# EAGLE design zig-v4-test (EAGLE 5.10)
BOM: EXCLUDE; PARTNO: ERJ-3EKF51R0V
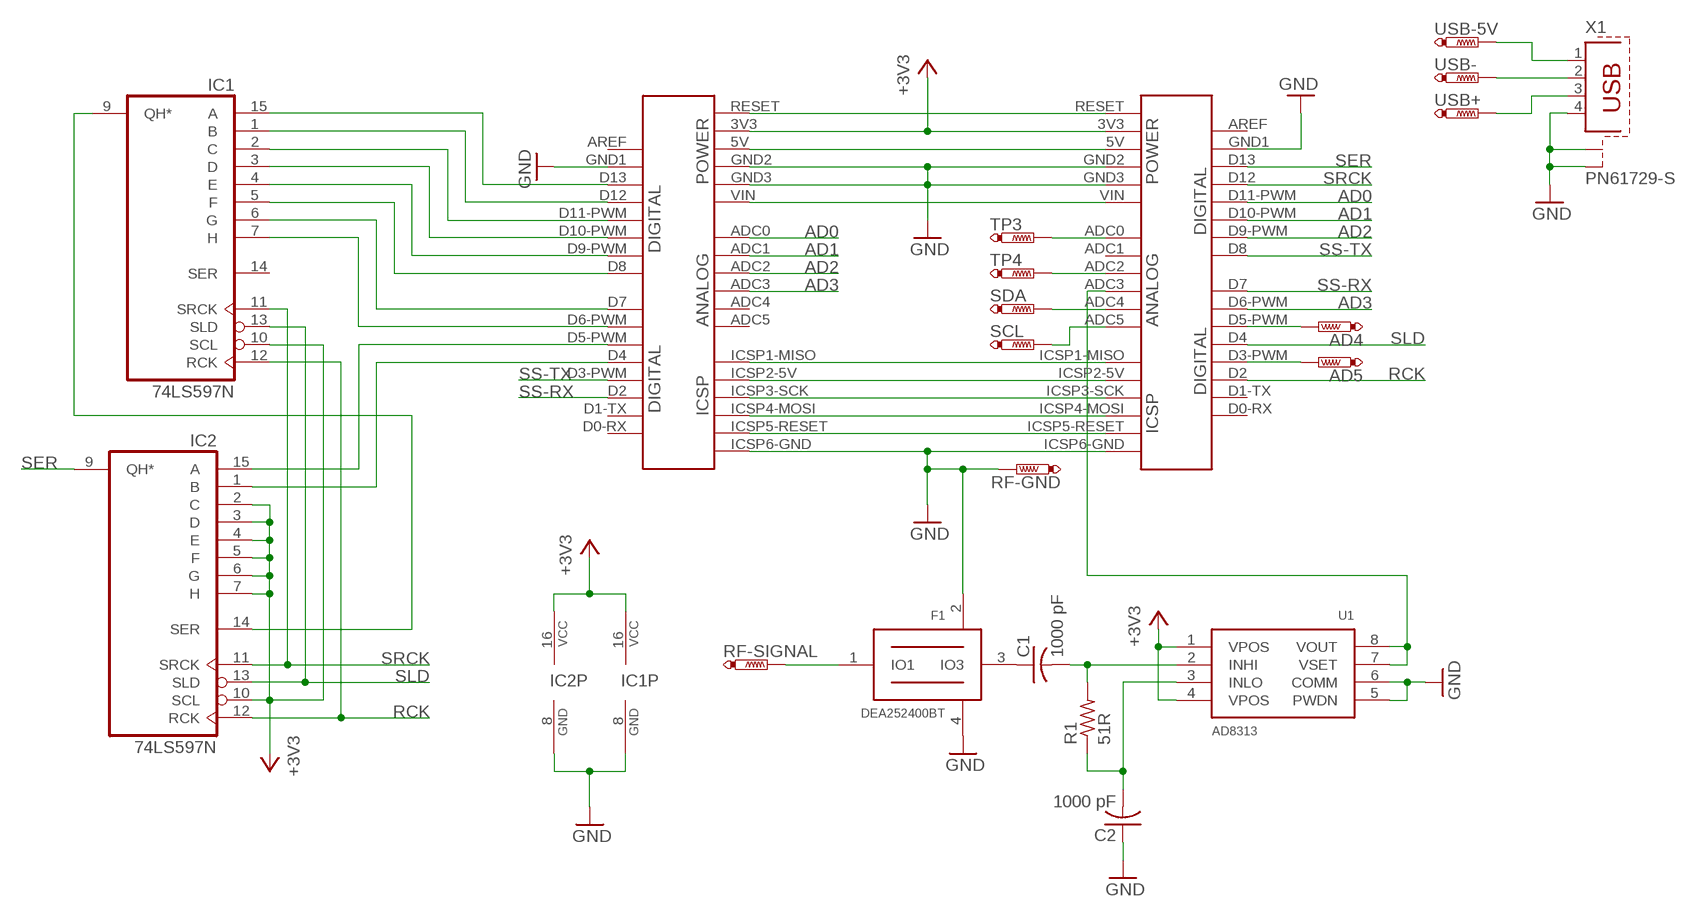
[diagram p0: schematic, sheet 1]

## Parts
AD4  PTR1PAD1-13  [P1-13]
AD5  PTR1PAD1-13  [P1-13]
C1  1000 pF  C-USC0805  [C0805]
C2  1000 pF  C-USC0805  [C0805]
DUT1  ARDUINO-2009-ICSP-TEST  [ARDUINO-2009-ICSP]
F1  DEA252400BT  [DEA2524]
IC1  74LS597N  [DIL16]
IC2  74LS597N  [DIL16]
R1  51R  R-US_R0805  [R0805]
RF-GND  PTR1PAD1-13  [P1-13]
RF-SIGNAL  PTR1PAD1-13  [P1-13]
SCL  PTR1PAD1-13  [P1-13]
SDA  PTR1PAD1-13  [P1-13]
SHIELD1  2009-ICSP  [2009-ICSP]
TP3  PTR1PAD1-13  [P1-13]
TP4  PTR1PAD1-13  [P1-13]
U1  AD8313  [MSOP8]
USB+  PTR1PAD1-13  [P1-13]
USB-  PTR1PAD1-13  [P1-13]
USB-5V  PTR1PAD1-13  [P1-13]
X1  PN61729-S  [PN61729-S]

## Nets
+3V3: DUT1.3V3 IC1.10(SCL) IC1.16(VCC) IC2.2(C) IC2.3(D) IC2.4(E) IC2.5(F) IC2.6(G) IC2.7(H) IC2.10(SCL) IC2.16(VCC) SHIELD1.3V3 U1.1(VPOS) U1.4(VPOS)
AD0: DUT1.ADC0 SHIELD1.D11-PWM(D11)
AD1: DUT1.ADC1 SHIELD1.D10-PWM(D10)
AD2: DUT1.ADC2 SHIELD1.D9-PWM(D9)
AD3: DUT1.ADC3 SHIELD1.D6-PWM(D6)
GND: C2.1 DUT1.GND1 DUT1.GND2 DUT1.GND3 DUT1.ICSP6-GND(GND-ICSP) F1.2(GND) F1.4(GND) IC1.8(GND) IC2.8(GND) RF-GND.TP SHIELD1.GND1 SHIELD1.GND2 SHIELD1.GND3 SHIELD1.ICSP6-GND(GND-ICSP) U1.5(PWDN) U1.6(COMM) X1.4 X1.S1 X1.S2
N$1: DUT1.RESET SHIELD1.RESET
N$2: AD5.TP SHIELD1.D3-PWM(D3)
N$3: DUT1.5V SHIELD1.5V
N$4: F1.1(IO1) RF-SIGNAL.TP
N$5: SHIELD1.ADC3 U1.7(VSET) U1.8(VOUT)
N$6: DUT1.VIN SHIELD1.VIN
N$7: C1.1 F1.3(IO3)
N$8: AD4.TP SHIELD1.D5-PWM(D5)
N$9: C2.2 R1.1 U1.3(INLO)
N$10: C1.2 R1.2 U1.2(INHI)
N$11: SDA.TP SHIELD1.ADC4
N$12: SCL.TP SHIELD1.ADC5
N$13: DUT1.ICSP1-MISO(MISO) SHIELD1.ICSP1-MISO(MISO)
N$14: DUT1.ICSP2-5V(5V-ICSP) SHIELD1.ICSP2-5V(5V-ICSP)
N$15: DUT1.ICSP3-SCK(SCK) SHIELD1.ICSP3-SCK(SCK)
N$16: DUT1.ICSP4-MOSI(MOSI) SHIELD1.ICSP4-MOSI(MOSI)
N$17: DUT1.ICSP5-RESET(RESET-ICSP) SHIELD1.ICSP5-RESET(RESET-ICSP)
N$18: SHIELD1.ADC2 TP4.TP
N$19: SHIELD1.ADC0 TP3.TP
N$20: DUT1.D13 IC1.15(A)
N$21: DUT1.D12 IC1.1(B)
N$22: DUT1.D11-PWM(D11) IC1.2(C)
N$23: DUT1.D10-PWM(D10) IC1.3(D)
N$24: DUT1.D9-PWM(D9) IC1.4(E)
N$25: DUT1.D8 IC1.5(F)
N$26: DUT1.D7 IC1.6(G)
N$27: DUT1.D6-PWM(D6) IC1.7(H)
N$28: DUT1.D5-PWM(D5) IC2.15(A)
N$29: DUT1.D4 IC2.1(B)
N$30: USB-5V.TP X1.1
N$31: USB-.TP X1.2
N$32: USB+.TP X1.3
N$34: IC1.9(QH*) IC2.14(SER)
RCK: IC1.12(RCK) IC2.12(RCK) SHIELD1.D2
SER: IC2.9(QH*) SHIELD1.D13
SLD: IC1.13(SLD) IC2.13(SLD) SHIELD1.D4
SRCK: IC1.11(SRCK) IC2.11(SRCK) SHIELD1.D12
SS-RX: DUT1.D2 SHIELD1.D7
SS-TX: DUT1.D3-PWM(D3) SHIELD1.D8
Unconnected: DUT1.ADC4 DUT1.ADC5 DUT1.AREF DUT1.D0-RX(D0) DUT1.D1-TX(D1) IC1.14(SER) SHIELD1.ADC1 SHIELD1.AREF SHIELD1.D0-RX(D0) SHIELD1.D1-TX(D1)

## Library data of the parts
AD4 AD5 RF-GND RF-SIGNAL SCL SDA TP3 TP4 USB+ USB- USB-5V = testpad:PTR1: TEST PIN
C1 C2 = resistor:C-US: CAPACITOR, American symbol
DUT1 = test-fixtures:ARDUINO-2009-ICSP-TEST
F1 = atmega128rfa1:DEA252400BT: TDK DEA252400BT 2.45 GHz bandpass filter
IC1 IC2 = 74xx-us:74*597: 8-bit SHIFT REGISTER, input latch
R1 = resistor:R-US_: RESISTOR, American symbol
SHIELD1 = arduino-shields:2009-ICSP
U1 = atmega128rfa1:AD8313
X1 = con-berg:PN61729-S: BERG USB connector

## Board
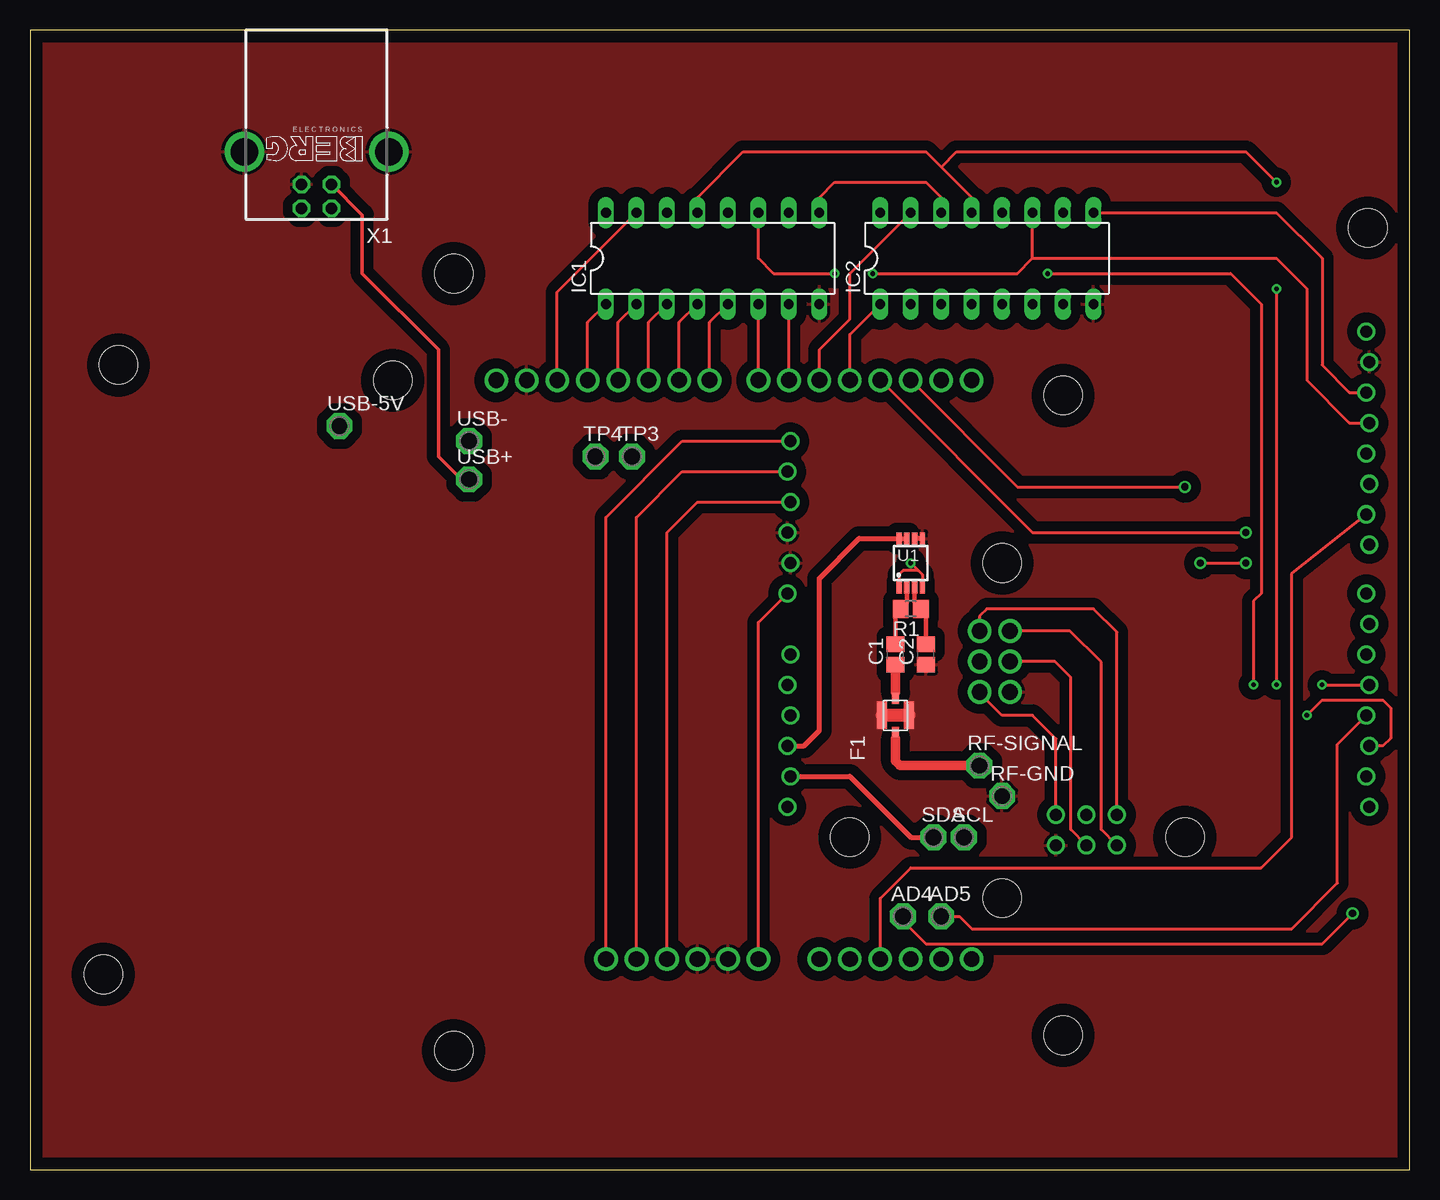
[diagram p1: board, top side]
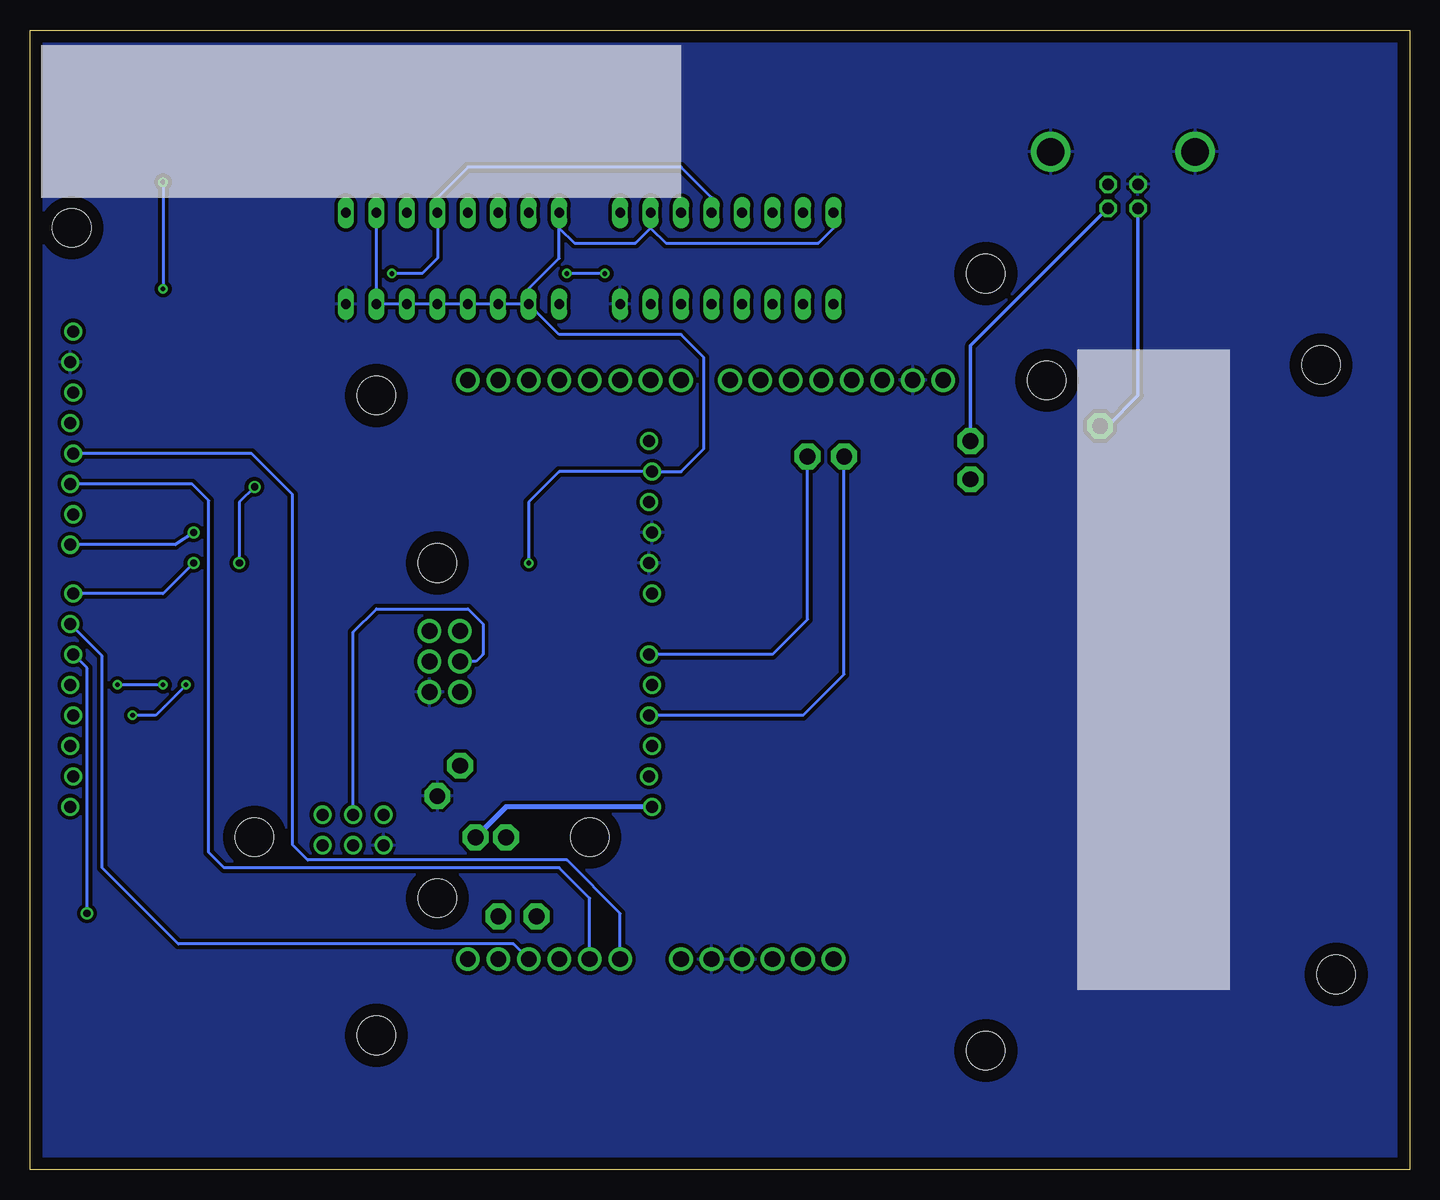
[diagram p2: board, bottom side, seen from below]

Size 115 x 95 mm. Coordinates in mm from the lower left corner, seen from the top.
Outline: 0,0 115,0 115,95 0,95 0,0
Copper layers (1*16): Top 0.035mm / dielectric 1.5mm / Bottom 0.035mm
Design rules "default": minimum track width 10mil, minimum drill 24mil, track to track 8mil, track to pad 8mil, pad to pad 8mil, via to via 8mil, smd to smd 8mil, copper to edge 40mil, drill to drill 8mil, minimum pad ring 10mil, minimum via ring 8mil, stop-mask expansion 4mil, vias tented up to drill 0mil, thermal gap 10mil
Holes 3.2 mm at 7.38,67.07 35.32,74.69 86.12,64.53 86.12,11.19 35.32,9.92 6.11,16.27

### Footprints (pad centres in the part's own frame; a part is rotated, then mirrored left to right if it is on the bottom)
P1-13 = drill 1.321 pad 2.159 octagon: TP 0,0
C0805 = smd 1.3 x 1.5: 1 -0.85,0; 2 0.85,0
ARDUINO-2009-ICSP = drill 1.321 round: 3V3 35.56,2.54; 5V 38.1,2.54; ADC0 50.8,2.54; ADC1 53.34,2.54; ADC2 55.88,2.54; ADC3 58.42,2.54; ADC4 60.96,2.54; ADC5 63.5,2.54; AREF 23.876,50.8; D0-RX 63.5,50.8; D1-TX 60.96,50.8; D2 58.42,50.8; D3-PWM 55.88,50.8; D4 53.34,50.8; D5-PWM 50.8,50.8; D6-PWM 48.26,50.8; D7 45.72,50.8; D8 41.656,50.8; D9-PWM 39.116,50.8; D10-PWM 36.576,50.8; D11-PWM 34.036,50.8; D12 31.496,50.8; D13 28.956,50.8; GND1 26.416,50.8; GND2 40.64,2.54; GND3 43.18,2.54; ICSP1-MISO 64.16,29.896; ICSP2-5V 66.7,29.896; ICSP3-SCK 64.16,27.356; ICSP4-MOSI 66.7,27.356; ICSP5-RESET 64.16,24.816; ICSP6-GND 66.7,24.816; RESET 33.02,2.54; VIN 45.72,2.54 | hole 3.2: 15.24,50.8; 66.04,35.56; 66.04,7.62
DEA2524 = smd 0.9 x 0.6: 1 -1.4,0; 3 1.4,0 | smd 2.3 x 0.85: 2 0,1.125; 4 0,-1.125
DIL16 = drill 0.813 long: 1 -8.89,-3.81; 2 -6.35,-3.81; 3 -3.81,-3.81; 4 -1.27,-3.81; 5 1.27,-3.81; 6 3.81,-3.81; 7 6.35,-3.81; 8 8.89,-3.81; 9 8.89,3.81; 10 6.35,3.81; 11 3.81,3.81; 12 1.27,3.81; 13 -1.27,3.81; 14 -3.81,3.81; 15 -6.35,3.81; 16 -8.89,3.81
R0805 = smd 1.3 x 1.5: 1 -0.85,0; 2 0.85,0
2009-ICSP = drill 1 round: 3V3 35.56,2.413; 5V 38.1,2.667; ADC0 50.8,2.667; ADC1 53.34,2.413; ADC2 55.88,2.667; ADC3 58.42,2.413; ADC4 60.96,2.667; ADC5 63.5,2.413; AREF 23.876,50.673; D0-RX 63.5,50.927; D1-TX 60.96,50.673; D2 58.42,50.927; D3-PWM 55.88,50.673; D4 53.34,50.927; D5-PWM 50.8,50.673; D6-PWM 48.26,50.927; D7 45.72,50.673; D8 41.656,50.927; D9-PWM 39.116,50.673; D10-PWM 36.576,50.927; D11-PWM 34.036,50.673; D12 31.496,50.927; D13 28.956,50.673; GND1 26.416,50.927; GND2 40.64,2.413; GND3 43.18,2.667; ICSP1-MISO 64.16,29.896; ICSP2-5V 66.7,29.896; ICSP3-SCK 64.16,27.356; ICSP4-MOSI 66.7,27.356; ICSP5-RESET 64.16,24.816; ICSP6-GND 66.7,24.816; RESET 33.02,2.667; VIN 45.72,2.413 | hole 3.2: 15.24,50.8; 66.04,35.56; 66.04,7.62
MSOP8 = smd 0.45 x 1: 1 -0.975,-2.05; 2 -0.325,-2.05; 3 0.325,-2.05; 4 0.975,-2.05; 5 0.975,2.05; 6 0.325,2.05; 7 -0.325,2.05; 8 -0.975,2.05
PN61729-S = drill 0.95 octagon: 1 1.25,4.71; 2 -1.25,4.71; 3 -1.25,2.71; 4 1.25,2.71 | drill 2.3 pad 2.9 round: S1 -6.02,0; S2 6.02,0

### Placement (x,y rotation side)
AD4  72.78,21.1 0 top
AD5  75.96,21.1 0 top
C1  72.15,42.94 90 top
C2  74.69,42.94 90 top
DUT1  15,15 0 top
F1  72.15,37.86 90 top
IC1  56.91,75.96 0 top
IC2  79.77,75.96 0 top
R1  73.42,46.75 180 top
RF-GND  81.04,31.13 0 top
RF-SIGNAL  79.14,33.67 0 top
SCL  77.87,27.7 0 top
SDA  75.33,27.7 0 top
SHIELD1  60.72,93.74 270 top
TP3  50.18,59.45 0 top
TP4  47.13,59.45 0 top
U1  73.42,50.56 0 top
USB+  36.59,57.55 0 top
USB-  36.59,60.72 0 top
USB-5V  25.8,61.99 0 top
X1  23.89,84.85 180 top

### Tracks (layer width: path | path; a pad name or v marks a point on that pad's centre or on a via)
+3V3  (via drill 0.38)
  Top 0.254: SHIELD1.3V3 54.37,58.18 50.56,54.37 DUT1.3V3 | U1.1 72.44,49.59 72.78,49.92 74.06,49.92 | U1.4 74.4,49.59 74.06,49.92 | v73.42,50.56 74.06,49.92
  Bottom 0.254: IC2.2 70.88,69.61 60.72,69.61 58.81,67.7 58.81,60.09 60.72,58.18 SHIELD1.3V3 70.88,58.18 73.42,55.64 v73.42,50.56 | IC2.2 73.42,73.42 70.88,75.96 70.88,78.5 | 70.88,78.5 IC2.16 | IC2.2 IC2.3 IC2.4 IC2.5 IC2.6 IC2.7 IC2.10 | IC1.16 48.02,78.5 49.29,77.23 61.99,77.23 63.26,78.5 | 63.26,78.5 IC1.10 | 63.26,78.5 64.53,77.23 69.61,77.23 70.88,78.5
AD0
  Bottom 0.254: DUT1.ADC0 65.8,21.35 70.25,25.8 91.83,25.8 93.11,27.06 93.11,56.27 96.53,59.7 SHIELD1.D11-PWM
AD1
  Bottom 0.254: DUT1.ADC1 68.34,22.62 70.88,25.16 98.82,25.16 100.09,26.43 100.09,55.77 101.49,57.16 SHIELD1.D10-PWM
AD2
  Top 0.254: DUT1.ADC2 70.88,22.62 73.42,25.16 102.63,25.16 105.17,27.7 105.17,49.67 SHIELD1.D9-PWM
AD3
  Bottom 0.254: DUT1.ADC3 74.69,18.81 102.63,18.81 108.98,25.16 108.98,42.81 SHIELD1.D6-PWM
GND
  Top 0.406: U1.5 U1.6
  Top 1.1: F1.4 F1.2
  pour Top (isolate 0.813): -0.24,95.01 115.33,95.01 115.33,-0.24 -0.24,-0.24
  pour Bottom (isolate 0.305): -0.24,95.01 115.33,95.01 115.33,-0.24 -0.24,-0.24
N$1
  Top 0.254: DUT1.RESET 48.02,54.37 54.37,60.72 SHIELD1.RESET
N$2
  Top 0.254: AD5.TP 77.48,21.1 78.5,20.08 105.17,20.08 108.98,23.89 108.98,35.45 SHIELD1.D3-PWM
N$3
  Top 0.254: DUT1.5V 53.1,53.1 55.64,55.64 SHIELD1.5V
N$4
  Top 0.254: 72.15,35.95 F1.1
  Top 0.8: RF-SIGNAL.TP 72.53,33.67 72.15,34.05 72.15,35.95
N$5
  Top 0.406: SHIELD1.ADC3 64.53,35.32 65.8,36.59 65.8,49.29 69.12,52.61 U1.8 U1.7
N$6
  Top 0.254: DUT1.VIN 60.72,45.61 SHIELD1.VIN
N$7
  Top 0.391: F1.3 72.15,39.77
  Top 0.8: 72.15,39.77 C1.1
N$8  (via drill 0.6)
  Top 0.254: AD4.TP 72.78,20.71 74.69,18.81 107.71,18.81 v110.25,21.35
  Bottom 0.254: v110.25,21.35 110.25,41.8 SHIELD1.D5-PWM
N$9
  Top 0.391: U1.3 73.75,47.27 R1.1 74.69,46.33 C2.2
N$10
  Top 0.391: U1.2 73.09,47.27 R1.2 72.15,46.33 C1.2
N$11
  Top 0.406: SHIELD1.ADC4 68.34,32.78 73.42,27.7 SDA.TP
N$12
  Bottom 0.406: SHIELD1.ADC5 75.33,30.24 SCL.TP
N$13
  Top 0.254: SHIELD1.ICSP1-MISO 90.62,44.79 88.66,46.75 79.77,46.75 79.16,46.14 DUT1.ICSP1-MISO
N$14
  Top 0.254: DUT1.ICSP2-5V 86.7,44.9 89.3,42.3 89.3,28.34 90.59,27.04 SHIELD1.ICSP2-5V
N$15
  Bottom 0.254: SHIELD1.ICSP3-SCK 88.08,44.79 86.12,46.75 78.5,46.75 77.23,45.48 77.23,42.94 77.81,42.36 DUT1.ICSP3-SCK
N$16
  Top 0.254: SHIELD1.ICSP4-MOSI 88.05,27.04 86.75,28.34 86.75,41.03 85.43,42.36 DUT1.ICSP4-MOSI
N$17
  Top 0.254: DUT1.ICSP5-RESET 79.16,39.74 81.04,37.86 83.58,37.86 85.54,35.9 SHIELD1.ICSP5-RESET
N$18
  Bottom 0.254: SHIELD1.ADC2 50.56,37.86 47.13,41.29 TP4.TP
N$19
  Bottom 0.254: SHIELD1.ADC0 53.1,42.94 50.18,45.86 TP3.TP
N$20
  Top 0.254: DUT1.D13 43.96,73.17 IC1.15
N$21
  Top 0.254: DUT1.D12 46.5,70.63 IC1.1
N$22
  Top 0.254: DUT1.D11-PWM 49.04,70.63 IC1.2
N$23
  Top 0.254: DUT1.D10-PWM 51.58,70.63 IC1.3
N$24
  Top 0.254: DUT1.D9-PWM 54.12,70.63 IC1.4
N$25
  Top 0.254: DUT1.D8 56.66,70.63 IC1.5
N$26
  Top 0.254: DUT1.D7 IC1.6
N$27
  Top 0.254: DUT1.D6-PWM IC1.7
N$28
  Top 0.254: DUT1.D5-PWM 65.8,68.34 68.34,70.88 68.34,74.69 IC2.15
N$29
  Top 0.254: DUT1.D4 68.34,69.61 IC2.1
N$30
  Bottom 0.305: USB-5V.TP 25.16,61.99 22.64,64.51 X1.1
N$31
  Bottom 0.305: USB-.TP 36.59,68.69 X1.2
N$32
  Top 0.305: USB+.TP 35.95,57.55 34.05,59.45 34.05,68.34 27.7,74.69 27.7,79.58 X1.3
N$34
  Top 0.254: IC1.9 65.8,81.04 67.07,82.31 74.69,82.31 75.96,81.04 IC2.14
RCK  (via drill 0.38)
  Top 0.254: SHIELD1.D2 112.79,35.32 113.42,35.95 113.42,38.5 112.79,39.13 107.71,39.13 v106.44,37.86 | v102,40.4 102,47.38 102.63,48.02 102.63,72.15 100.09,74.69 v84.85,74.69
  Bottom 0.254: IC1.12 58.18,81.04 60.72,83.58 78.5,83.58 81.04,81.04 IC2.12 81.04,75.96 82.31,74.69 v84.85,74.69 | v106.44,37.86 104.53,37.86 v102,40.4
SER
  Top 0.254: IC2.9 103.9,79.77 107.71,75.96 107.71,67.07 110,64.78 SHIELD1.D13
SLD  (via drill 0.38)
  Top 0.254: IC1.13 55.64,81.04 59.45,84.85 74.69,84.85 75.96,83.58 | 75.96,83.58 78.5,81.04 IC2.13 | v107.71,40.4 SHIELD1.D4 | v103.9,73.42 v103.9,40.4 | v103.9,82.31 101.36,84.85 77.23,84.85 75.96,83.58
  Bottom 0.254: v103.9,40.4 v107.71,40.4 | v103.9,82.31 v103.9,73.42
SRCK  (via drill 0.38)
  Top 0.254: IC1.11 60.72,75.96 61.99,74.69 v67.07,74.69 | v70.25,74.69 82.31,74.69 83.58,75.96 | 83.58,75.96 IC2.11 | 83.58,75.96 103.9,75.96 106.44,73.42 106.44,65.8 110,62.24 SHIELD1.D12
  Bottom 0.254: v67.07,74.69 v70.25,74.69
SS-RX  (via drill 0.6)
  Top 0.254: v97.55,50.56 v101.36,50.56 | v96.28,56.91 82.31,56.91 DUT1.D2
  Bottom 0.254: SHIELD1.D7 103.9,48.02 v101.36,50.56 | v97.55,50.56 97.55,55.64 v96.28,56.91
SS-TX  (via drill 0.6)
  Top 0.254: v101.36,53.1 83.58,53.1 DUT1.D3-PWM
  Bottom 0.254: SHIELD1.D8 102.88,52.08 v101.36,53.1